# Altium project optoIsolatorBoard.PrjPCB
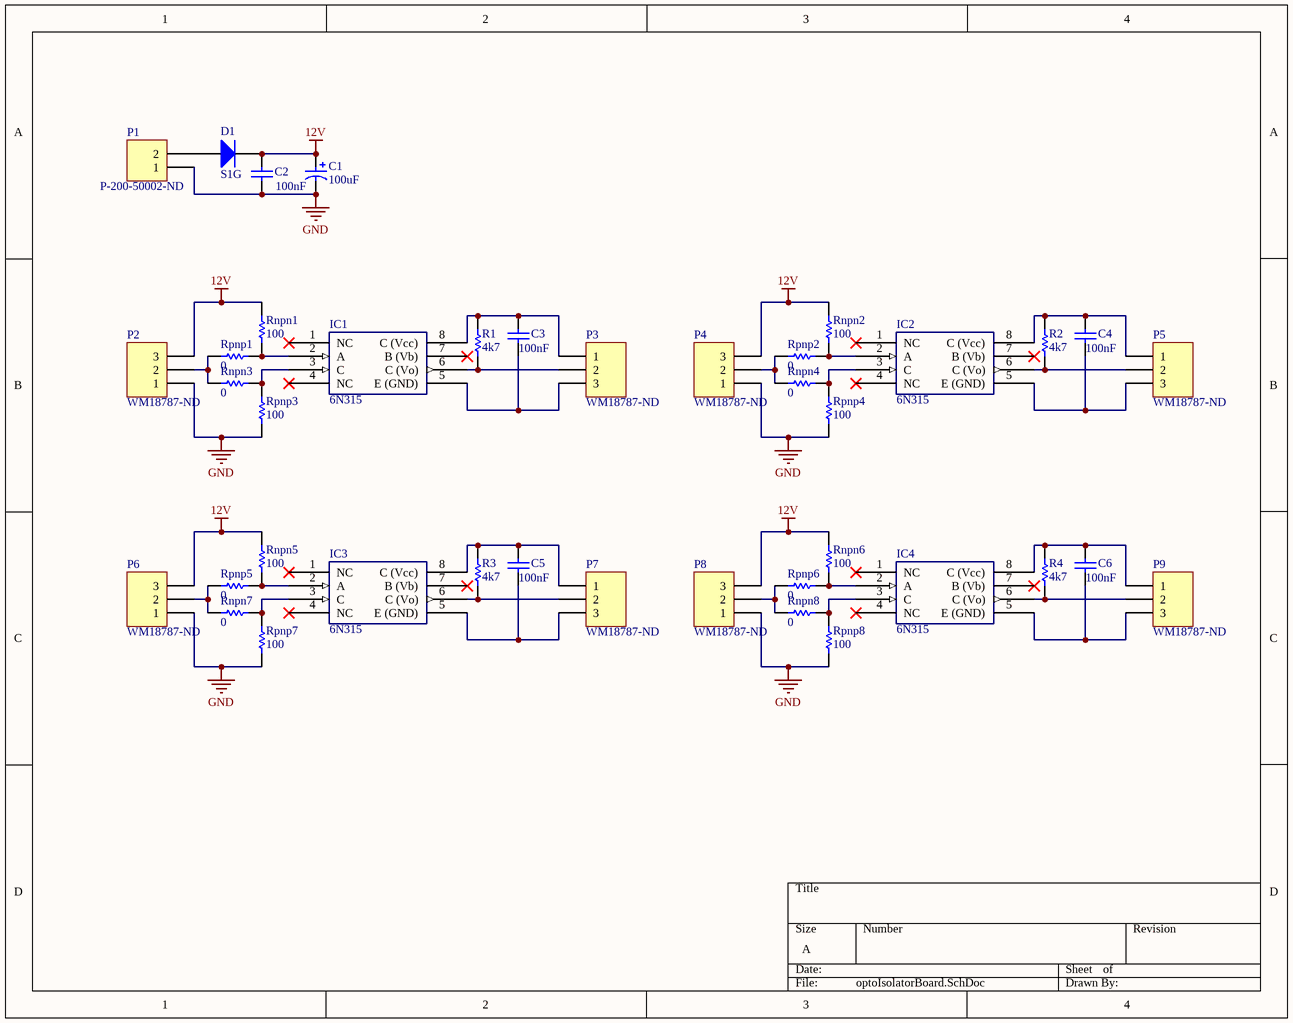
[diagram p0: optoIsolatorBoard.SchDoc]
1 sheet, 40 parts. Net scope: global (net labels, ports and power ports of the same name join across sheets).
Board file: optoIsolatorBoard.PcbDoc

## Sheet optoIsolatorBoard.SchDoc
size A

### Parts
C1  100uF  [CAP4-8X10]
C2  100nF  [1206_cap]
C3  value 100nF  [1206_cap]  (hidden comment: cap_1206)
C4  value 100nF  [1206_cap]  (hidden comment: cap_1206)
C5  value 100nF  [1206_cap]  (hidden comment: cap_1206)
C6  value 100nF  [1206_cap]  (hidden comment: cap_1206)
D1  S1G  [DO-214AC(SMA)]
IC1  6N315  [dip8 smd]
IC2  6N315  [dip8 smd]
IC3  6N315  [dip8 smd]
IC4  6N315  [dip8 smd]
P1  P-200-50002-ND  [Header2Combination]
P2  WM18787-ND  [molex_conn3]
P3  WM18787-ND  [molex_conn3]
P4  WM18787-ND  [molex_conn3]
P5  WM18787-ND  [molex_conn3]
P6  WM18787-ND  [molex_conn3]
P7  WM18787-ND  [molex_conn3]
P8  WM18787-ND  [molex_conn3]
P9  WM18787-ND  [molex_conn3]
R1  4k7  [1206_res]
R2  4k7  [1206_res]
R3  4k7  [1206_res]
R4  4k7  [1206_res]
Rnpn1  100  [1206_res]
Rnpn2  100  [1206_res]
Rnpn3  0  [1206_res]
Rnpn4  0  [1206_res]
Rnpn5  100  [1206_res]
Rnpn6  100  [1206_res]
Rnpn7  0  [1206_res]
Rnpn8  0  [1206_res]
Rpnp1  0  [1206_res]
Rpnp2  0  [1206_res]
Rpnp3  100  [1206_res]
Rpnp4  100  [1206_res]
Rpnp5  0  [1206_res]
Rpnp6  0  [1206_res]
Rpnp7  100  [1206_res]
Rpnp8  100  [1206_res]

### Nets
12V: C1.1 C2.2 D1.2(K) P2.3 P4.3 P6.3 P8.3 Rnpn1.1 Rnpn2.1 Rnpn5.1 Rnpn6.1
GND: C1.2 C2.1 P1.1 P2.1 P4.1 P6.1 P8.1 Rpnp3.2 Rpnp4.2 Rpnp7.2 Rpnp8.2
NetC3_1: C3.1 IC1.5(E_(GND)) P3.3
NetC3_2: C3.2 IC1.8(C_(Vcc)) P3.1 R1.2
NetC4_1: C4.1 IC2.5(E_(GND)) P5.3
NetC4_2: C4.2 IC2.8(C_(Vcc)) P5.1 R2.2
NetC5_1: C5.1 IC3.5(E_(GND)) P7.3
NetC5_2: C5.2 IC3.8(C_(Vcc)) P7.1 R3.2
NetC6_1: C6.1 IC4.5(E_(GND)) P9.3
NetC6_2: C6.2 IC4.8(C_(Vcc)) P9.1 R4.2
NetD1_1: D1.1(A) P1.2
NetIC1_2: IC1.2(A) Rnpn1.2 Rpnp1.1
NetIC1_3: IC1.3(C) Rnpn3.1 Rpnp3.1
NetIC1_6: IC1.6(C_(Vo)) P3.2 R1.1
NetIC2_2: IC2.2(A) Rnpn2.2 Rpnp2.1
NetIC2_3: IC2.3(C) Rnpn4.1 Rpnp4.1
NetIC2_6: IC2.6(C_(Vo)) P5.2 R2.1
NetIC3_2: IC3.2(A) Rnpn5.2 Rpnp5.1
NetIC3_3: IC3.3(C) Rnpn7.1 Rpnp7.1
NetIC3_6: IC3.6(C_(Vo)) P7.2 R3.1
NetIC4_2: IC4.2(A) Rnpn6.2 Rpnp6.1
NetIC4_3: IC4.3(C) Rnpn8.1 Rpnp8.1
NetIC4_6: IC4.6(C_(Vo)) P9.2 R4.1
NetP2_2: P2.2 Rnpn3.2 Rpnp1.2
NetP4_2: P4.2 Rnpn4.2 Rpnp2.2
NetP6_2: P6.2 Rnpn7.2 Rpnp5.2
NetP8_2: P8.2 Rnpn8.2 Rpnp6.2

Not connected (* = marked no-connect by the designer): IC1 1(NC)* 4(NC)* 7(B_(Vb))*; IC2 1(NC)* 4(NC)* 7(B_(Vb))*; IC3 1(NC)* 4(NC)* 7(B_(Vb))*; IC4 1(NC)* 4(NC)* 7(B_(Vb))*

### Library data of the parts
C1 = cap5-8x10: electrolytic capacitor; Value: 100uF; Supplier 1: Farnell; Supplier Part Number 1: 9451188; Supplier 2: Mouser; Supplier Part Number 2: 667-ECA-1EHG101
C2-C6 = cap_1206: Capacitor; Published: 8-Jun-2000; LatestRevisionDate: 17-Jul-2002; LatestRevisionNote: Re-released for DXP Platform.; PackageReference: RAD-0.3; Publisher: Altium Limited
  C2: Value: 100nF; Supplier 1: Mouser; Supplier Part Number 1: 581-12065C104K; Supplier 2: Mouser; Supplier Part Number 2: 80-C1206C104K5R
D1 = S1G: High Conductance Fast Diode; Published: 8-Jun-2000; LatestRevisionDate: 17-Jul-2002; LatestRevisionNote: Re-released for DXP Platform.; DatasheetDocument: 1997; PackageReference: DO-35; Publisher: Altium Limited; Code_JEDEC: DO-204-AH; ComponentLink1Description: Manufacturer Link; ComponentLink1URL: http://www.fairchildsemi.com/; ComponentLink2Description: Datasheet; ComponentLink2URL: http://www.fairchildsemi.com/ds/1N%2F1N4148.pdf; Supplier 1: Mouser; Supplier Part Number 1: 512-S1G; Supplier 2: Digi-Key; Supplier Part Number 2: S1GFSCT-ND
IC1-IC4 = 6N315: Single Channel, High Speed  Optocouplers; Value: 6N315; Supplier 1: Digi-Key; Supplier Part Number 1: 160-1785-ND; Supplier 2: Mouser; Supplier Part Number 2: 859-6N135S; Supplier 3: Digi-Key; Supplier Part Number 3: 6N135-ND
P1 = Header2ConPow: Header, 2-Pin; LatestRevisionDate: 17-Jul-2002; LatestRevisionNote: Re-released for DXP Platform.; Publisher: Altium Limited; Value: P-200-50002-ND; Supplier 1: Digi-Key; Supplier Part Number 1: P-200-50002-ND
P2-P9 = Molex conn3: Header, 3-Pin; LatestRevisionDate: 17-Jul-2002; LatestRevisionNote: Re-released for DXP Platform.; Publisher: Altium Limited; Value: WM18787-ND; Supplier 1: Digi-Key; Supplier Part Number 1: WM18787-ND; Supplier 2: Mouser; Supplier Part Number 2: 538-22-04-1041
R1-R4 Rnpn1-Rnpn8 Rpnp1-Rpnp8 = res: Resistor; Published: 8-Jun-2000; LatestRevisionDate: 17-Jul-2002; LatestRevisionNote: Re-released for DXP Platform.; PackageReference: AXIAL-0.3; Publisher: Altium Limited
  R1: Value: 4k7; Supplier 1: Digi-Key; Supplier Part Number 1: 311-4.7KERDKR-ND; Supplier 2: Mouser; Supplier Part Number 2: 71-CRCW1206-4.7K-E3
  R2-R4: Value: 4k7
  Rnpn1 Rnpn2 Rnpn5 Rnpn6 Rpnp3 Rpnp4 Rpnp7 Rpnp8: Value: 100; Supplier 1: Digi-Key; Supplier Part Number 1: 311-100FRCT-ND; Supplier 2: Mouser; Supplier Part Number 2: 71-CRCW1206-100-E3
  Rnpn3 Rnpn4 Rnpn7 Rnpn8 Rpnp1 Rpnp2 Rpnp5 Rpnp6: Value: 0; Supplier 1: Mouser; Supplier Part Number 1: 71-CRCW1206-0-E3; Supplier 2: Digi-Key; Supplier Part Number 2: P0.0ECT-ND